# Altium schematic sheet MainBoard.SchDoc
size A4; SheetNumber: 1; SheetTotal: 3
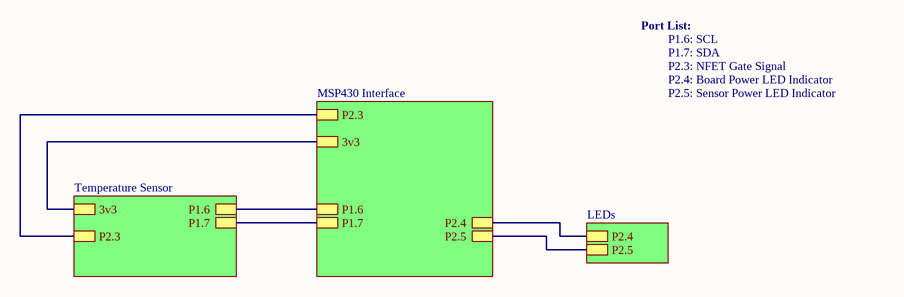
[diagram p0: MainBoard.SchDoc]

## Sub-sheets
LEDs = File Name: P2.4, P2.5
MSP430 Interface = File Name: P2.3, 3v3, P1.6, P1.7, P2.4, P2.5
Temperature Sensor = File Name: 3v3, P2.3, P1.6, P1.7

## Nets
(unnamed): sheet Temperature Sensor/3v3, sheet MSP430 Interface/3v3
(unnamed): sheet Temperature Sensor/P2.3, sheet MSP430 Interface/P2.3
(unnamed): sheet Temperature Sensor/P1.6, sheet MSP430 Interface/P1.6
(unnamed): sheet Temperature Sensor/P1.7, sheet MSP430 Interface/P1.7
(unnamed): sheet MSP430 Interface/P2.4, sheet LEDs/P2.4
(unnamed): sheet MSP430 Interface/P2.5, sheet LEDs/P2.5

## Notes on the sheet
- Port List:
- P1.6: SCL
- P1.7: SDA
- P2.3: NFET Gate Signal
- P2.4: Board Power LED Indicator
- P2.5: Sensor Power LED Indicator